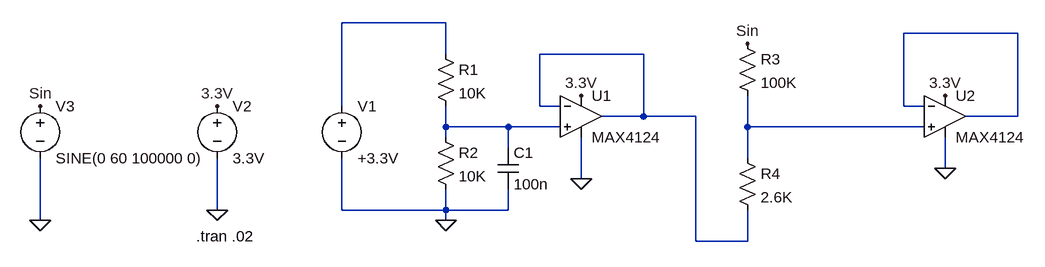
[diagram p0: schematic Voltage_Sensor.asc]
Voltage_Sensor.asc, the LTspice schematic file:
Version 4.1
SHEET 1 880 680
WIRE -16 32 -176 32
WIRE 864 48 688 48
WIRE -16 80 -16 32
WIRE 288 80 128 80
WIRE -176 160 -176 32
WIRE 128 160 128 80
WIRE 160 160 128 160
WIRE 688 160 688 48
WIRE 720 160 688 160
WIRE 288 176 288 80
WIRE 288 176 224 176
WIRE 368 176 288 176
WIRE 864 176 864 48
WIRE 864 176 784 176
WIRE -16 192 -16 160
WIRE 80 192 -16 192
WIRE 160 192 80 192
WIRE 448 192 448 144
WIRE 720 192 448 192
WIRE -16 208 -16 192
WIRE 80 224 80 192
WIRE 448 240 448 192
WIRE 752 256 752 208
WIRE 192 272 192 208
WIRE -368 320 -368 240
WIRE -176 320 -176 240
WIRE -16 320 -16 288
WIRE -16 320 -176 320
WIRE 80 320 80 288
WIRE 80 320 -16 320
WIRE -640 336 -640 240
WIRE -16 336 -16 320
WIRE 368 368 368 176
WIRE 448 368 448 320
WIRE 448 368 368 368
FLAG -16 336 0
FLAG -368 320 0
FLAG -368 160 3.3V
FLAG 192 272 0
FLAG 192 144 3.3V
FLAG -640 336 0
FLAG -640 160 Sin
FLAG 448 64 Sin
FLAG 752 144 3.3V
FLAG 752 256 0
SYMBOL OpAmps\\MAX4124 192 112 R0
SYMATTR InstName U1
SYMBOL res -32 64 R0
SYMATTR InstName R1
SYMATTR Value 10K
SYMATTR SpiceLine tol=0.1 pwr=100m
SYMBOL res -32 192 R0
SYMATTR InstName R2
SYMATTR Value 10K
SYMATTR SpiceLine tol=0.1 pwr=100m
SYMBOL voltage -176 144 R0
WINDOW 123 0 0 Left 0
WINDOW 39 0 0 Left 0
SYMATTR InstName V1
SYMATTR Value +3.3V
SYMBOL voltage -368 144 R0
WINDOW 123 0 0 Left 0
WINDOW 39 0 0 Left 0
SYMATTR InstName V2
SYMATTR Value 3.3V
SYMBOL cap 64 224 R0
SYMATTR InstName C1
SYMATTR Value 100n
SYMBOL OpAmps\\MAX4124 752 112 R0
SYMATTR InstName U2
SYMBOL res 432 48 R0
SYMATTR InstName R3
SYMATTR Value 100K
SYMATTR SpiceLine tol=0.1 pwr=100m
SYMBOL res 432 224 R0
SYMATTR InstName R4
SYMATTR Value 2.6K
SYMATTR SpiceLine tol=0.1 pwr=100m
SYMBOL voltage -640 144 R0
WINDOW 123 0 0 Left 0
WINDOW 39 0 0 Left 0
SYMATTR InstName V3
SYMATTR Value SINE(0 60 100000 0)
TEXT -400 360 Left 2 !.tran .02

The netlist it stands for:
* Voltage_Sensor.asc
X§U1 N004 N003 3.3V 0 N003 MAX4124  ; pins In+ In- V+ V- OUT
R1 N001 N004 10K tol=0.1 pwr=100m
R2 N004 0 10K tol=0.1 pwr=100m
V1 N001 0 +3.3V
V2 3.3V 0 3.3V
C1 N004 0 100n
X§U2 N005 N002 3.3V 0 N002 MAX4124  ; pins In+ In- V+ V- OUT
R3 Sin N005 100K tol=0.1 pwr=100m
R4 N005 N003 2.6K tol=0.1 pwr=100m
V3 Sin 0 SINE(0 60 100000 0)
.tran .02
.backanno
.end